# EAGLE design box85x85 (EAGLE 6.6.0)
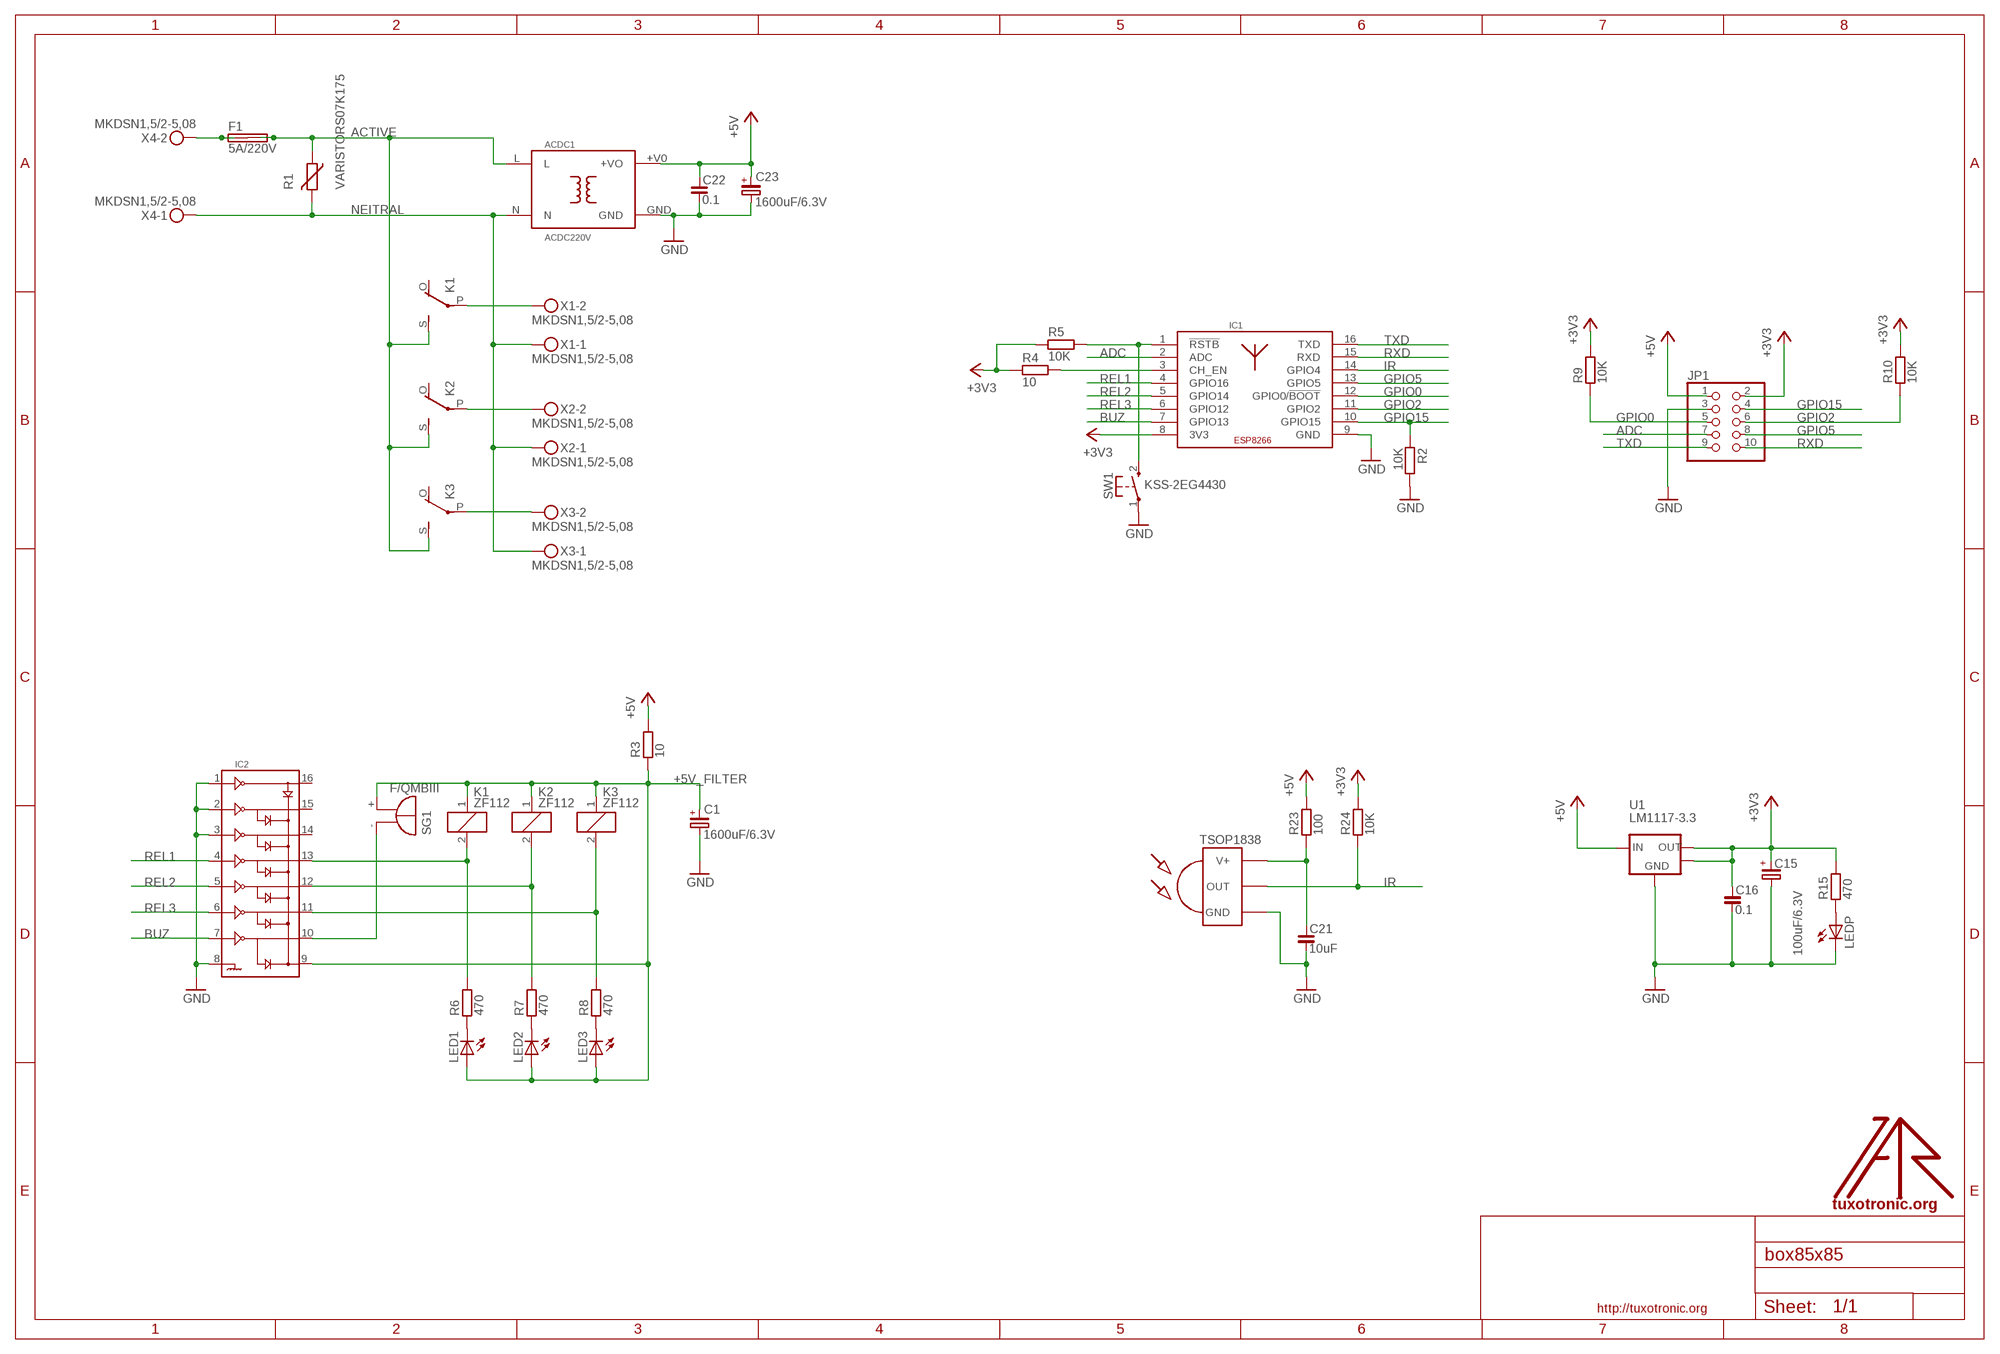
[diagram p0: schematic, sheet 1]

## Parts
ACDC1  ACDC220V  [ACDC600MA]
C1  1600uF/6.3V  CP_E-035X080  [CE-035X080]
C15  100uF/6.3V  CP_SMCD  [SMC_D]
C16  0.1  C_0805  [C0805]
C21  10uF  C_0805  [C0805]
C22  0.1  C_0805  [C0805]
C23  1600uF/6.3V  CP_E-035X080  [CE-035X080]
F1  5A/220V  SHK20L  [SHK20L]
IC1  ESP-12  [ESP12]
IC2  ULN2003D  [SO16]
IR1  TSOP1838  [TSOP18XX]
JP1  PINHD-2X5_2.54  [2X05]
K1  ZF112  [ZF112]
K2  ZF112  [ZF112]
K3  ZF112  [ZF112]
LED1  LED3MM  [LED3MM]
LED2  LED3MM  [LED3MM]
LED3  LED3MM  [LED3MM]
LEDP  LED3MM  [LED3MM]
R1  VARISTORS07K175  [S07K175]
R2  10K  R_0805  [R0805]
R3  10  R_0805  [R0805]
R4  10  R_0805  [R0805]
R5  10K  R_0805  [R0805]
R6  470  R_0805  [R0805]
R7  470  R_0805  [R0805]
R8  470  R_0805  [R0805]
R9  10K  R_0805  [R0805]
R10  10K  R_0805  [R0805]
R15  470  R_0805  [R0805]
R23  100  R_0805  [R0805]
R24  10K  R_0805  [R0805]
SG1  F/QMBIII  [F/QMBIII]
SW1  KSS-2EG4430  [KSS-2EG4430]
U1  LM1117-3.3  [SOT223]
U$1  LOGO  [TT_LOGO]
X1  MKDSN1,5/2-5,08  [MKDSN1,5/2-5,08]
X2  MKDSN1,5/2-5,08  [MKDSN1,5/2-5,08]
X3  MKDSN1,5/2-5,08  [MKDSN1,5/2-5,08]
X4  MKDSN1,5/2-5,08  [MKDSN1,5/2-5,08]

## Nets
+3V3: C15.+ C16.1 IC1.8(3V3) JP1.2 R4.1 R5.1 R9.2 R10.2 R15.2 R24.2 U1.2(OUT) U1.4(MASS)
+5V: ACDC1.+V0(+VO) C22.1 C23.+ JP1.1 R3.2 R23.2 U1.3(IN)
+5V_FILTER: C1.+ IC2.9 K1.1 K2.1 K3.1 LED1.A LED2.A LED3.A R3.1 SG1.+(-)
ACTIVE: ACDC1.L F1.2A F1.2B K1.S(2:S) K2.S(2:S) K3.S(2:S) R1.1
ADC: IC1.2(ADC) JP1.7
BUZ: IC1.7(GPIO13) IC2.7
GND: ACDC1.GND C1.- C15.- C16.2 C21.2 C22.2 C23.- IC1.9(GND) IC2.1 IC2.2 IC2.3 IC2.8 IR1.GND JP1.3 LEDP.K(C) R2.2 SW1.1(P) U1.1(GND)
GPIO0: IC1.12(GPIO0/!BOOT) JP1.5 R9.1
GPIO2: IC1.11(GPIO2) JP1.6 R10.1
GPIO5: IC1.13(GPIO5) JP1.8
GPIO15: IC1.10(GPIO15) JP1.4 R2.1
IR: IC1.14(GPIO4) IR1.OUT R24.1
N$1: F1.1A F1.1B X4.2
N$2: K1.P(2:P) X1.2
N$3: K2.P(2:P) X2.2
N$4: K3.P(2:P) X3.2
N$5: IC2.13 K1.2 R6.2
N$6: IC2.12 K2.2 R7.2
N$11: LED1.K(C) R6.1
N$12: IC2.11 K3.2 R8.2
N$14: IC2.10 SG1.-(+)
N$15: IC1.3(CH_EN) R4.2
N$16: IC1.1(!RSTB) R5.2 SW1.2(S)
N$17: LED2.K(C) R7.1
N$18: LED3.K(C) R8.1
N$29: C21.1 IR1.VCC(V+) R23.1
N$46: LEDP.A R15.1
NEITRAL: ACDC1.N R1.2 X1.1 X2.1 X3.1 X4.1
REL1: IC1.4(GPIO16) IC2.4
REL2: IC1.5(GPIO14) IC2.5
REL3: IC1.6(GPIO12) IC2.6
RXD: IC1.15(RXD) JP1.10
TXD: IC1.16(TXD) JP1.9
Unconnected: IC2.14 IC2.15 IC2.16 K1.O(2:O) K2.O(2:O) K3.O(2:O)

## Library data of the parts
ACDC1 = dcdc-isolated:ACDC220V: input Input Voltage: AC86 ~ 264V Frequency: 47 ~ 440Hz Impact of current: 16A/AC220V Output Output voltage: 5V, linear adjustment >1% Out current: 0.6A Output voltage (mVP-P): Ripple and noise <1% Temperature coefficient: +-0.2% maintain time 20ms
C1 C23 = rc-master:CP_: POLARIZED CAP
C15 = rc-master-smd:CP_: POLARIZED CAP
C16 C21 C22 = rc-master-smd:C_: NON-POLARIZED CAP
F1 = fuse:SHK20L: FUSE HOLDER 5 x 20 mm, SH contact, SHH1 Schukat, E1073 Buerklin
IC1 = esp-modules:ESP-12: ESP-07 have SMD antenna and external antenna connector ESP-12 have PCB antenna Pull-down GPIO15 to GND Connect CH_EN to 3V3
IC2 = transistor-arrays:ULN2003: OUTPUT CURRENT 500mA PER DRIVER (600mA PEAK) OUTPUT VOLTAGE 50V
IR1 = tsop-1:TSOP1838: IR Receiver and Demodulator
JP1 = pinhead-fixdrills:PINHD-2X5: PIN HEADER
K1-K3 = myrelays:ZF112: RELAY 1 x switch
LED1-LED3 LEDP = led:LED: LED OSRAM: - CHIPLED LG R971, LG N971, LY N971, LG Q971, LY Q971, LO R971, LY R971 LH N974, LH R974 LS Q976, LO Q976, LY Q976 LO Q996 - Hyper CHIPLED LW Q18S LB Q993, LB Q99A, LB R99A - SideLED LS A670, LO A670, LY A670, LG A670, LP A670 LB A673, LV A673, LT A673, LW A673 LH A674 LY A675 LS A676, LA A676, LO A676, LY A676, LW A676 LS A679, LY A679, LG A679 - Hyper Micro SIDELED® LS Y876, LA Y876, LO Y876, LY Y876 LT Y87S - SmartLED LW L88C, LW L88S LB L89C, LB L89S, LG L890 LS L89K, LO L89K, LY L89K LS L896, LA L896, LO L896, LY L896 - TOPLED LS T670, LO T670, LY T670, LG T670, LP T670 LSG T670, LSP T670, LSY T670, LOP T670, LYG T670 LG T671, LOG T671, LSG T671 LB T673, LV T673, LT T673, LW T673 LH T674 LS T676, LA T676, LO T676, LY T676, LB T676, LH T676, LSB T676, LW T676 LB T67C, LV T67C, LT T67C, LS T67K, LO T67K, LY T67K, LW E67C LS E67B, LA E67B, LO E67B, LY E67B, LB E67C, LV E67C, LT E67C LW T67C LS T679, LY T679, LG T679 LS T770, LO T770, LY T770, LG T770, LP T770 LB T773, LV T773, LT T773, LW T773 LH T774 LS E675, LA E675, LY E675, LS T675 LS T776, LA T776, LO T776, LY T776, LB T776 LHGB T686 LT T68C, LB T68C - Hyper Mini TOPLED® LB M676 - Mini TOPLED Santana® LG M470 LS M47K, LO M47K, LY M47K Source: http://www.osram.convergy.de - LUMILED® LXK2-PW12-R00, LXK2-PW12-S00, LXK2-PW14-U00, LXK2-PW14-V00 LXK2-PM12-R00, LXK2-PM12-S00, LXK2-PM14-U00 LXK2-PE12-Q00, LXK2-PE12-R00, LXK2-PE12-S00, LXK2-PE14-T00, LXK2-PE14-U00 LXK2-PB12-K00, LXK2-PB12-L00, LXK2-PB12-M00, LXK2-PB14-N00, LXK2-PB14-P00, LXK2-PB14-Q00 LXK2-PR12-L00, LXK2-PR12-M00, LXK2-PR14-Q00, LXK2-PR14-R00 LXK2-PD12-Q00, LXK2-PD12-R00, LXK2-PD12-S00 LXK2-PH12-R00, LXK2-PH12-S00 LXK2-PL12-P00, LXK2-PL12-Q00, LXK2-PL12-R00 Source: www.luxeon.com
R1 = varistor:VARISTOR: VARISTOR
R2-R10 R15 R23 R24 = rc-master-smd:R_: RESISTOR
SG1 = buzzer:F/QMBIII: BUZZER Source: Buerklin
SW1 = buttons:KSS-2EG4430: Size: 3x6mm Height: 5mm from PCB Rating: DC12v 50mA Travel: 0.25±0.10mm Operating Force: 180±50gf Return Force: 60gf min Contact resistance: 100m? max Insulation resistance: 100M? min Operating life?50,000 cycles
U1 = vreg-linear:LM1117: Linear regulators
U$1 = logo:LOGO
X1-X4 = con-phoenix-508:MKDSN1,5/2-5,08: MKDSN 1,5/ 2-5,08 Printklemme Nennstrom: 13,5 A Nennspannung: 250 V Rastermaß: 5,08 mm Polzahl: 2 Anschlussart: Schraubanschluss Montage: Löten Anschlussrichtung Leiter/Platine: 0 ° Artikelnummer: 1729128 Source: http://eshop.phoenixcontact.com .. 1729128.pdf

## Board
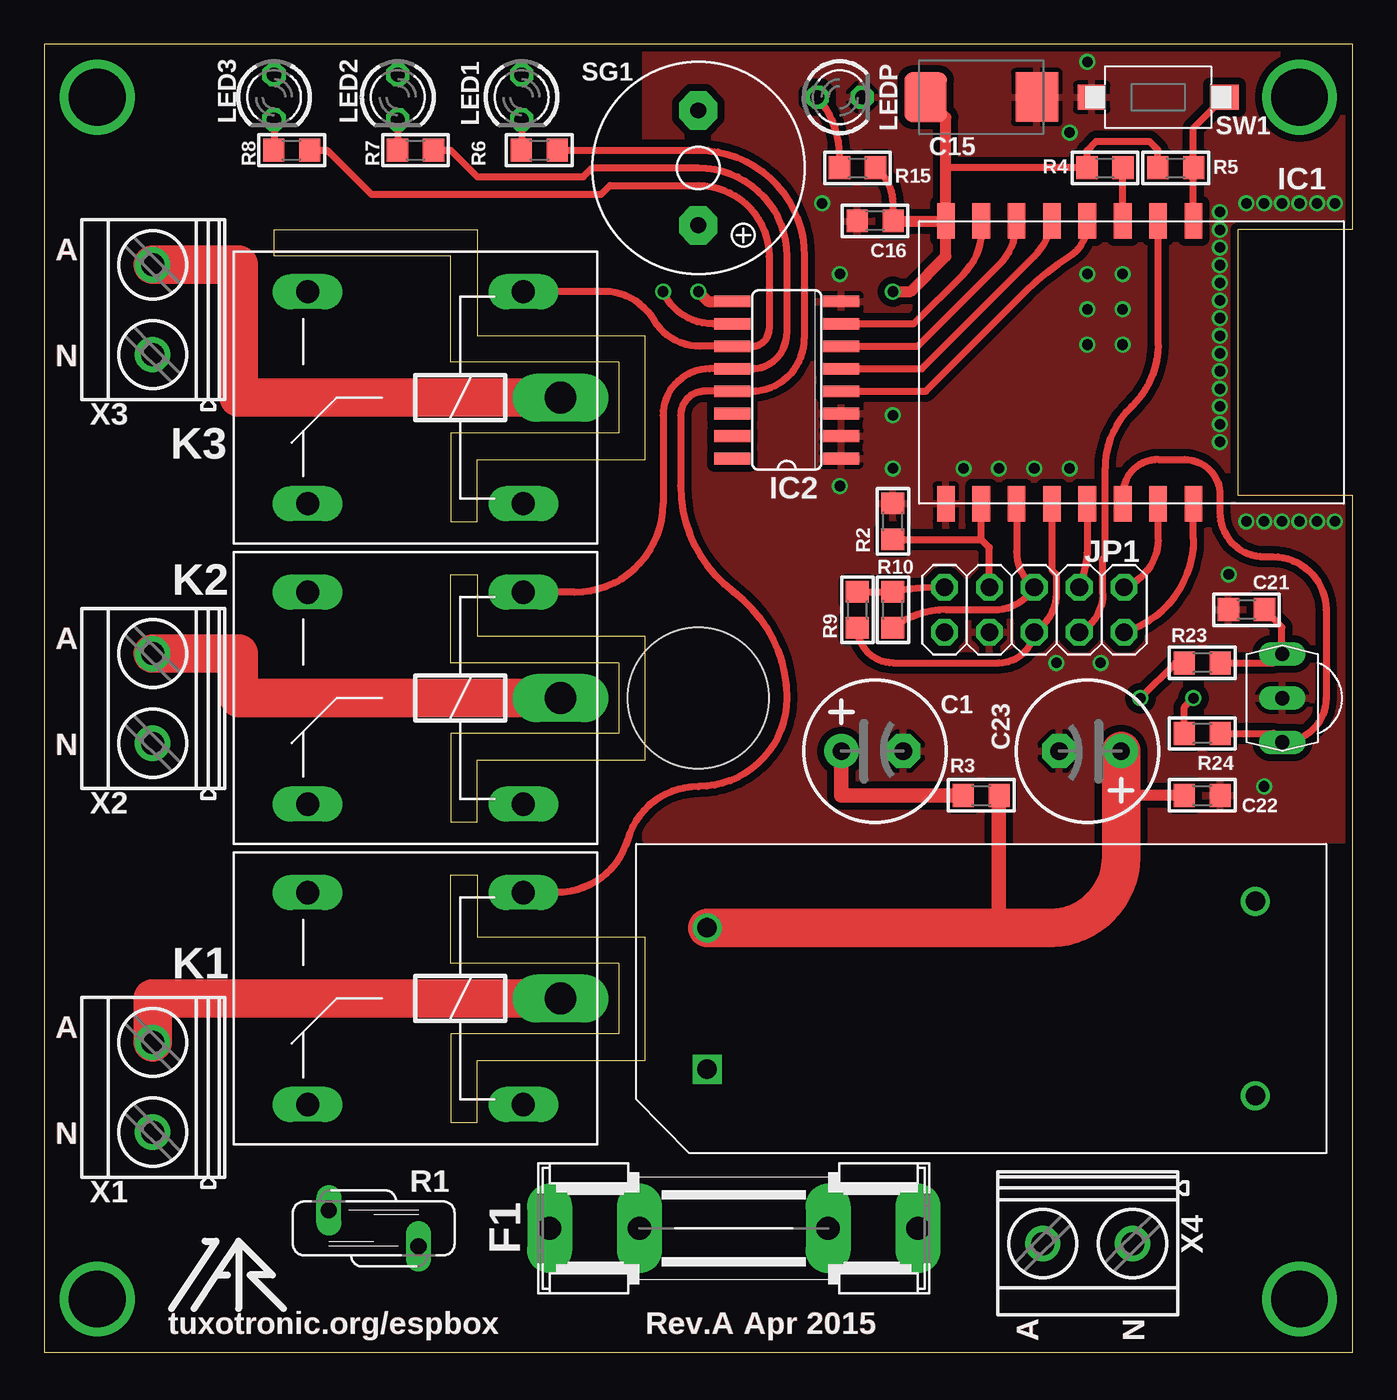
[diagram p1: board, top side]
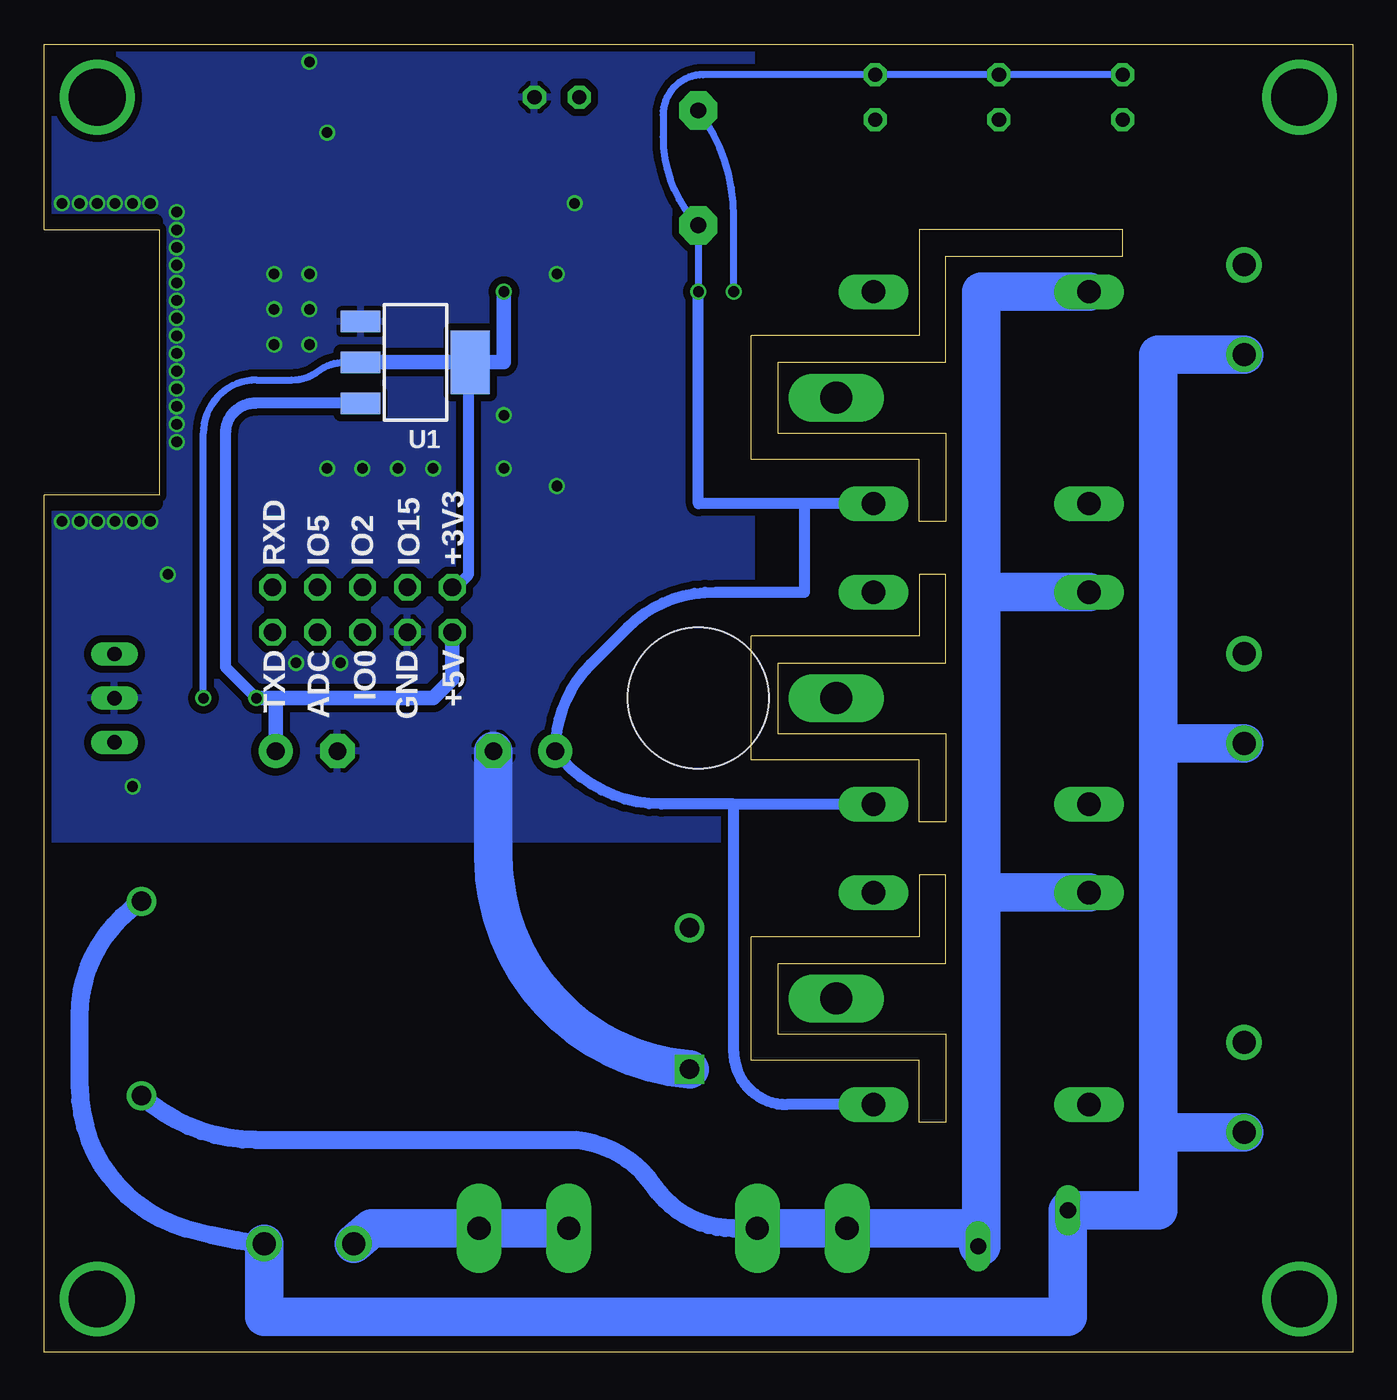
[diagram p2: board, bottom side, seen from below]

Size 74 x 74 mm. Coordinates in mm from the lower left corner, seen from the top.
Outline: 0,0 74,0 74,48.5 67.5,48.5 67.5,63.5 74,63.5 74,74 0,74 0,0
Outline: 32.5,39 23,39 23,44 24.5,44 24.5,40.5 34,40.5 34,33.5 24.5,33.5 24.5,30 23,30 23,35 32.5,35 32.5,39
Outline: 32.5,56 23,56 23,62 13,62 13,63.5 24.5,63.5 24.5,57.5 34,57.5 34,50.5 24.5,50.5 24.5,47 23,47 23,52 32.5,52 32.5,56
Outline: 32.5,22 23,22 23,27 24.5,27 24.5,23.5 34,23.5 34,16.5 24.5,16.5 24.5,13 23,13 23,18 32.5,18 32.5,22
Copper layers (1*16): Top 0.035mm / dielectric 1.5mm / Bottom 0.035mm
Design rules "SeeedStudio_2layer_DRU_no_angle_20140221 *": minimum track width 6mil, minimum drill 12mil, track to track 6mil, track to pad 6mil, pad to pad 6mil, via to via 6mil, smd to smd 0mil, copper to edge 10mil, drill to drill 10mil, minimum pad ring 10mil, minimum via ring 6mil, stop-mask expansion 2mil, vias tented up to drill 0.7mm, thermal gap 10mil
Holes 8 mm at 37,37

### Footprints (pad centres in the part's own frame; a part is rotated, then mirrored left to right if it is on the bottom)
ACDC600MA = drill 1.1: +V0 -15.5,4; L 15.5,-5.5; N 15.5,5.5 | drill 1.1 square: GND -15.5,-4
CE-035X080 = drill 1 pad 1.93: + -1.905,0 | drill 1 pad 1.93 octagon: - 1.587,0
SMC_D = smd 2.4 x 2.8: + -3.15,0; - 3.15,0
C0805 = smd 1.2 x 1.3: 1 -1.016,0; 2 1.016,0
SHK20L = drill 1.321 pad 2.54 long: 1A -10.414,0; 1B -5.334,0; 2A 10.414,0; 2B 5.334,0
ESP12 = smd 1 x 2: 1 -4,-8; 2 -2,-8; 3 0,-8; 4 2,-8; 5 4,-8; 6 6,-8; 7 8,-8; 8 10,-8; 9 10,8; 10 8,8; 11 6,8; 12 4,8; 13 2,8; 14 0,8; 15 -2,8; 16 -4,8
SO16 = smd 0.66 x 2.032: 1 -4.445,-3.073; 2 -3.175,-3.073; 3 -1.905,-3.073; 4 -0.635,-3.073; 5 0.635,-3.073; 6 1.905,-3.073; 7 3.175,-3.073; 8 4.445,-3.073; 9 4.445,3.073; 10 3.175,3.073; 11 1.905,3.073; 12 0.635,3.073; 13 -0.635,3.073; 14 -1.905,3.073; 15 -3.175,3.073; 16 -4.445,3.073
TSOP18XX = drill 0.813 long: GND -0.001,-0.027; OUT -2.501,-0.027; VCC 2.499,-0.027
2X05 = drill 1 octagon: 1 -5.08,-1.27; 2 -5.08,1.27; 3 -2.54,-1.27; 4 -2.54,1.27; 5 0,-1.27; 6 0,1.27; 7 2.54,-1.27; 8 2.54,1.27; 9 5.08,-1.27; 10 5.08,1.27
ZF112 = drill 1.321 long: 1 -6.096,5.994; 2 -6.096,-5.994; O 6.096,5.994; S 6.096,-5.994 | drill 1.803 long: P -8.204,0
LED3MM = drill 0.8 octagon: A -1.27,0; K 1.27,0
S07K175 = drill 0.914 long: 1 -1.016,-2.54; 2 1.016,2.54
R0805 = smd 1.2 x 1.3: 1 -1.016,0; 2 1.016,0
F/QMBIII = drill 0.9 pad 2.159 octagon: + 3.251,0; - -3.251,0
KSS-2EG4430 = smd 1.6 x 1.4: 1 -3.75,0; 2 3.75,0
SOT223 = smd 1.219 x 2.235: 1 -2.311,-3.099; 2 0,-3.099; 3 2.311,-3.099 | smd 3.6 x 2.2: 4 0,3.099
MKDSN1,5/2-5,08 = drill 1.3 pad 2: 1 -2.561,0.025; 2 2.519,0.025

### Placement (x,y rotation side)
ACDC1  53,20 0 top
C1  47,34 0 top
C15  53,71 0 top
C16  47,64 180 top
C21  68,42 180 top
C22  65.5,31.5 0 top
C23  59,34 180 top
F1  39,7 180 top
IC1  61,56 180 top
IC2  42,55 90 top
IR1  70,37 90 top
JP1  56,42 0 top
K1  21,20 180 top
K2  21,37 180 top
K3  21,54 180 top
LED1  27,71 270 top
LED2  20,71 270 top
LED3  13,71 270 top
LEDP  45,71 0 top
R1  18.64,7 90 top
R2  48,47 90 top
R3  53,31.5 0 top
R4  60,67 0 top
R5  64,67 0 top
R6  28,68 0 top
R7  21,68 0 top
R8  14,68 0 top
R9  46,42 90 top
R10  48,42 90 top
R15  46,67 0 top
R23  65.5,39 180 top
R24  65.5,35 180 top
SG1  37,67 270 top
SW1  63,71 0 top
U1  53,56 270 bottom
U$1  11,5 0 top
X1  6.16,15 90 top
X2  6.16,37 90 top
X3  6.16,59 90 top
X4  59,6.16 180 top

### Tracks (layer width: path | path; a pad name or v marks a point on that pad's centre or on a via)
+3V3  (via drill 0.6)
  Top 0.406: 51,67 R4.1 58.98,67.98 59.5,68.5 62.5,68.5 62.98,68.02 R5.1 | C16.1 48.02,65 arc53 R15.2 | R9.2 R10.2 arc-12 50.42,43.27 JP1.2 | R24.2 64.48,36.48 v65,37
  Top 0.61: IC1.8 51,67 51,69.85 C15.+ | v48,60 49,60 51,62 IC1.8 | C16.1 IC1.8
  Bottom 0.406: v65,37 65,52 arc90 62,55 60,55 arc-37 58.5,55.5 arc37 57,56 U1.2
  Bottom 0.61: JP1.2 50.73,43.27 50,44 50,56 49.92,55.92
  Bottom 0.813: U1.2 U1.4 | U1.4 50,56 | U1.4 48,56 v48,60
+5V  (via drill 0.6)
  Top 0.406: R23.2 64,39 v62,37
  Top 0.61: C22.1 60.91,31.5
  Top 0.813: R3.2 54,31.25 54,24
  Top 2.184: ACDC1.+V0 54,24 arc3 57,24 arc89 60.91,28 60.91,31.5 C23.+
  Bottom 0.61: U1.3 62.06,53.69 arc-90 63.75,52 63.75,38.75 v62,37
  Bottom 0.813: JP1.1 50.92,38.08 52,37 61,37 | 61,37 v62,37 | C23.+ 60.91,36.91 61,37
+5V_FILTER  (via drill 0.6)
  Top 0.61: v37,60 37.55,59.45 IC2.9
  Top 0.813: R3.1 45.09,31.5 C1.+
  Bottom 0.406: LED3.A LED2.A LED1.A 36.73,72.27 arc-90 39,70 39,68.75 arc-44 SG1.+ v37,60
  Bottom 0.61: 35,31 35,17 arc-90 32.01,14.01 K1.1 | 35,31 K2.1 | 35,31 39.09,31 arc53 C1.+ arc46 43.09,38.91 41,41 arc46 36,43 31,43 31,48.01 | K3.1 31,48.01 | 31,48.01 37,48.01 v37,60
ACTIVE
  Bottom 1.016: F1.2B 35,7 arc56 39.5,9.38 arc-51 44,12 62,12 arc42 ACDC1.L
  Bottom 2.184: K3.S 21,59.99 21,42.99 | 21,42.99 21,25.99 | 21,25.99 21,5.98 R1.1 21.18,7 F1.2A F1.2B | K1.S 21,25.99 | K2.S 21,42.99
ADC
  Top 0.406: IC1.2 63,57 arc-46 61.5,53.5 arc46 60,50 60,45 59.88,44.88 59.88,42.88 arc-64 JP1.7
BUZ
  Top 0.406: IC2.7 49.17,58.17 52,61 arc53 IC1.7
GND  (via drill 0.6)
  Bottom 2.184: C1.- 48.59,28 arc-85 ACDC1.GND
  other vias: 44,65 67,44 48,50 48,53 45,61 52,50 45,49 69,32 61,61 61,59 57.25,39 59.75,39 73,47 66.5,51.5 66.5,52.5 66.5,53.5 66.5,54.5 66.5,55.5 66.5,56.5 66.5,57.5 66.5,58.5 66.5,59.5 66.5,60.5 66.5,61.5 66.5,62.5 66.5,63.5 66.5,64.5 68,65 69,65 70,65 71,65 72,65 73,65 68,47 69,47 70,47 71,47 72,47 59,73 58,69 61,57 59,61 59,59 59,57 54,50 56,50 58,50
  pour Top (isolate 0.406, rank 5): 75,75 34,75 34,29 75,29
  pour Bottom (isolate 0.406, rank 5): 76,76 34,76 34,29 76,29
GPIO0
  Top 0.406: IC1.12 57,44.25 57.25,44 57.25,42.98 arc-58 JP1.5 arc-82 54,39 48,39 arc-90 R9.1
GPIO2
  Top 0.406: IC1.11 55,45.27 arc53 JP1.6 arc-58 53.73,42 51,42 arc37 R10.1
GPIO5
  Top 0.406: IC1.13 59,45.73 arc-21 JP1.8
GPIO15
  Top 0.406: R2.1 53,45.98 | 53,45.98 IC1.10 | JP1.4 53.46,45.52 53,45.98
IR
  Top 0.406: IC1.14 61,48.5 arc-90 63,50.5 64.5,50.5 arc-90 66.5,48.5 66.5,47.5 arc90 69,45 69.5,45 arc-90 72.5,42 72.5,37 arc-89 IR1.OUT | IR1.OUT | R24.1 69.53,35 IR1.OUT
N$1
  Bottom 2.184: X4.2 55.48,7 F1.1A F1.1B
N$2
  Top 2.184: K1.P 6.13,20 X1.2
N$3
  Top 2.184: K2.P 11,37 11,39.52 X2.2
N$4
  Top 2.184: K3.P 11,54 11,61.52 X3.2
N$5
  Top 0.406: K1.2 29,26 arc74 33,29 arc-74 37,32 arc90 42,37 arc53 39,43 arc-53 36,49 36,53 arc-90 37.37,54.37 IC2.13 39.99,54.37 arc90 43,57.38 43,62 arc90 37,68 R6.2
N$6
  Top 0.406: K2.2 30,43 arc90 35,48 35,53 arc-90 37.63,55.63 IC2.12 40.01,55.63 arc90 42,57.62 42,62 arc90 37,67 31,67 30.5,66.5 24.5,66.5 23,68 R7.2
N$7  (via drill 3.2)
  other vias: 3,3
N$8  (via drill 3.2)
  other vias: 71,3
N$9  (via drill 3.2)
  other vias: 3,71
N$10  (via drill 3.2)
  other vias: 71,71
N$11
  Top 0.406: LED1.K 27,68.02 R6.1
N$12
  Top 0.406: K3.2 32,60 arc-52 34.5,58.38 arc59 37.09,56.91 IC2.11 40.03,56.91 arc90 41,57.88 41,62 arc90 37,66 32,66 31.5,65.5 18.5,65.5 16,68 R8.2
N$14  (via drill 0.6)
  Top 0.406: IC2.10 37.83,58.17 arc-66 v35,60
  Bottom 0.406: v35,60 35,64.25 arc-37 SG1.-
N$15
  Top 0.406: IC1.3 61,66.02 R4.2
N$16
  Top 0.406: IC1.1 65,67 | 65,67 65,69.25 SW1.2 | R5.2 65,67
N$17
  Top 0.406: LED2.K 20,68.02 R7.1
N$18
  Top 0.406: LED3.K 13,68.02 R8.1
N$29
  Top 0.406: R23.1 69.53,39 IR1.VCC 70,39.52 70,41.02 C21.1
N$46
  Top 0.406: R15.1 44.98,67.75 arc42 LEDP.A
NEITRAL
  Bottom 1.016: 61.56,6.56 X4.1 arc10 66,7 arc74 72,15 72,19 arc57 ACDC1.N
  Bottom 2.184: X3.1 11,56.44 11,34.44 | 11,34.44 11,12.44 | X2.1 11,34.44 | X1.1 11,12.44 | X4.1 61.56,2 16.09,2 R1.2 11,8.02 11,12.44
REL1
  Top 0.406: IC2.4 49.87,54.37 55.5,60 arc-13 58,62 arc62 IC1.4
REL2
  Top 0.406: IC2.5 49.63,55.63 56,62 arc37 IC1.5
REL3
  Top 0.406: IC2.6 49.41,56.91 54,61.5 arc46 IC1.6
RXD
  Top 0.406: IC1.15 63,46 arc-70 JP1.10
TXD
  Top 0.406: IC1.16 65,46 arc-73 JP1.9

### Text on the board
Top: A | N | A | N | A | N | tuxotronic.org/espbox | Rev.A Apr 2015 | A | N
tPlace: A | N | A | N | A | N | tuxotronic.org/espbox | Rev.A Apr 2015 | A | N
bPlace: +3V3 | IO15 | IO2 | IO5 | RXD | +5V | GND | IO0 | ADC | TXD